# EAGLE design imuv1.3 (EAGLE 7.4.0)
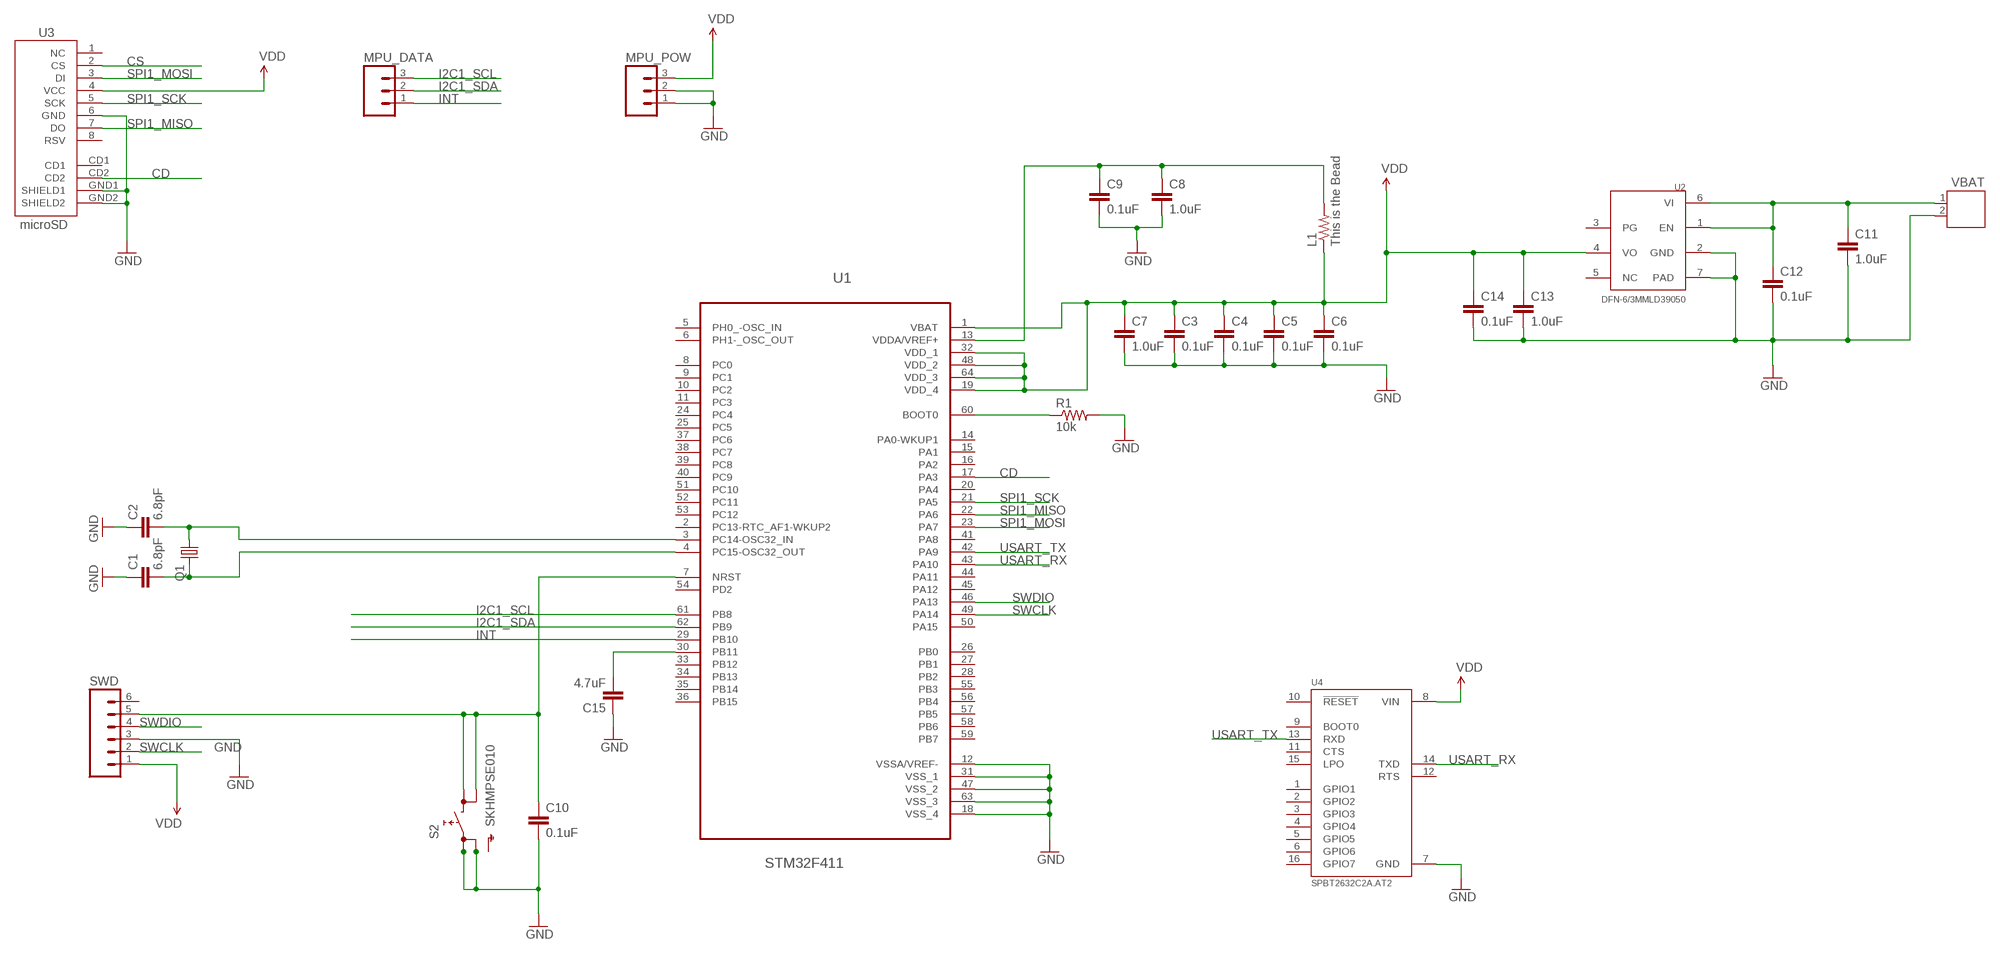
[diagram p0: schematic, sheet 1]

## Parts
C1  6.8pF  1.0PF-50V(-/+.25PF)(0603)  [0603-CAP]
C2  6.8pF  1.0PF-50V(-/+.25PF)(0603)  [0603-CAP]
C3  0.1uF  0.1UF-100V-10%(0603)  [0603-CAP]
C4  0.1uF  0.1UF-100V-10%(0603)  [0603-CAP]
C5  0.1uF  0.1UF-100V-10%(0603)  [0603-CAP]
C6  0.1uF  0.1UF-100V-10%(0603)  [0603-CAP]
C7  1.0uF  1.0UF-16V-10%(0603)  [0603-CAP]
C8  1.0uF  1.0UF-16V-10%(0603)  [0603-CAP]
C9  0.1uF  0.1UF-100V-10%(0603)  [0603-CAP]
C10  0.1uF  0.1UF-100V-10%(0603)  [0603-CAP]
C11  1.0uF  1.0UF-16V-10%(0603)  [0603-CAP]
C12  0.1uF  0.1UF-100V-10%(0603)  [0603-CAP]
C13  1.0uF  1.0UF-16V-10%(0603)  [0603-CAP]
C14  0.1uF  0.1UF-100V-10%(0603)  [0603-CAP]
C15  4.7uF  4.7UF-16V-20%,+80%-(1206)  [1206-CAP]
L1  This is the Bead  1OHM1/10W1%(0603)  [0603-RES]
MPU_DATA  M03PTH  [1X03]
MPU_POW  M03PTH  [1X03]
Q1  CRYSTALMM20SS  [MM20SS]
R1  10k  470OHM1/10W1%(0603)  [0603-RES]
S2  SKHMPSE010  [SKHMPXE010]
SWD  M06SILK_FEMALE_PTH  [1X06]
U1  STM32F411  STM32L152RBT6STM32F411  [QFP50P1200X1200X160-64N]
U2  DFN-6/3MMLD39050  [DFN-6/3MM]
U3  microSD  USD-SOCKETSMD  [MICRO-SD-SOCKET-PP]
U4  SPBT2632C2A.AT2  [XCVR_SPBT2632C2A.AT2]
VBAT  JST-PH2  [JST-PH2]

## Nets
CD: U1.17(PA3) U3.CD2
CS: U3.2(CS)
GND: C1.1 C2.1 C3.2 C4.2 C5.2 C6.2 C7.2 C8.2 C9.2 C10.2 C11.2 C12.2 C13.2 C14.2 C15.1 MPU_POW.1 MPU_POW.2 R1.2 S2.1(1.1) S2.2(1.2) SWD.3 U1.12(VSSA/VREF-) U1.18(VSS_4) U1.31(VSS_1) U1.47(VSS_2) U1.63(VSS_3) U2.2(GND) U2.7(PAD) U3.6(GND) U3.GND1(SHIELD1) U3.GND2(SHIELD2) U4.7(GND) VBAT.2
I2C1_SCL: MPU_DATA.3 U1.61(PB8)
I2C1_SDA: MPU_DATA.2 U1.62(PB9)
INT: MPU_DATA.1 U1.29(PB10)
N$1: C1.2 Q1.4 U1.4(PC15-OSC32_OUT)
N$2: C10.1 S2.3(2.1) S2.4(2.2) SWD.5 U1.7(NRST)
N$3: R1.1 U1.60(BOOT0)
N$4: C8.1 C9.1 L1.2 U1.13(VDDA/VREF+)
N$5: C2.2 Q1.1 U1.3(PC14-OSC32_IN)
N$6: C11.1 C12.1 U2.1(EN) U2.6(VI) VBAT.1
N$7: C15.2 U1.30(PB11)
SPI1_MISO: U1.22(PA6) U3.7(DO)
SPI1_MOSI: U1.23(PA7) U3.3(DI)
SPI1_SCK: U1.21(PA5) U3.5(SCK)
SWCLK: SWD.2 U1.49(PA14)
SWDIO: SWD.4 U1.46(PA13)
USART_RX: U1.43(PA10) U4.14(TXD)
USART_TX: U1.42(PA9) U4.13(RXD)
VDD: C3.1 C4.1 C5.1 C6.1 C7.1 C13.1 C14.1 L1.1 MPU_POW.3 SWD.1 U1.1(VBAT) U1.19(VDD_4) U1.32(VDD_1) U1.48(VDD_2) U1.64(VDD_3) U2.4(VO) U3.4(VCC) U4.8(VIN)
Unconnected: S2.5(SH) SWD.6 U1.2(PC13-RTC_AF1-WKUP2) U1.5(PH0_-OSC_IN) U1.6(PH1-_OSC_OUT) U1.8(PC0) U1.9(PC1) U1.10(PC2) U1.11(PC3) U1.14(PA0-WKUP1) U1.15(PA1) U1.16(PA2) U1.20(PA4) U1.24(PC4) U1.25(PC5) U1.26(PB0) U1.27(PB1) U1.28(PB2) U1.33(PB12) U1.34(PB13) U1.35(PB14) U1.36(PB15) U1.37(PC6) U1.38(PC7) U1.39(PC8) U1.40(PC9) U1.41(PA8) U1.44(PA11) U1.45(PA12) U1.50(PA15) U1.51(PC10) U1.52(PC11) U1.53(PC12) U1.54(PD2) U1.55(PB3) U1.56(PB4) U1.57(PB5) U1.58(PB6) U1.59(PB7) U3.1(NC) U3.8(RSV) U3.CD1 U4.1(GPIO1) U4.2(GPIO2) U4.3(GPIO3) U4.4(GPIO4) U4.5(GPIO5) U4.6(GPIO6) U4.9(BOOT0) U4.10(!RESET) U4.11(CTS) U4.12(RTS) U4.15(LPO) U4.16(GPIO7)

## Power pins joined to a net without a drawn wire
NC: U2.5(NC)
PG: U2.3(PG)

## Library data of the parts
C1 C2 = SparkFun-Capacitors:1.0PF-50V(-/+.25PF)(0603): CAP-07879; PROD_ID: CAP-07879; VALUE: 1.0pF
C3-C6 C9 C10 C12 C14 = SparkFun-Capacitors:0.1UF-100V-10%(0603): CAP-08390; PROD_ID: CAP-08390
C7 C8 C11 C13 = SparkFun-Capacitors:1.0UF-16V-10%(0603): CAP-00868; PROD_ID: CAP-00868
C15 = SparkFun-Capacitors:4.7UF-16V-20%,+80%-(1206): CAP-10300; PROD_ID: CAP-10300
L1 = SparkFun-Resistors:1OHM1/10W1%(0603): RES-08269; PROD_ID: RES-08269; VALUE: 1
MPU_DATA MPU_POW = SparkFun-Connectors:M03: Header 3 Standard 3-pin 0.1" header. Use with straight break away headers (SKU : PRT-00116), right angle break away headers (PRT-00553), swiss pins (PRT-00743), machine pins (PRT-00117), and female headers (PRT-00115). Molex polarized connector foot print use with SKU : PRT-08232 with associated crimp pins and housings.
Q1 = crystal:CRYSTAL: CRYSTAL; OC_FARNELL: unknown; OC_NEWARK: unknown
R1 = SparkFun-Resistors:470OHM1/10W1%(0603): RES-07869; PROD_ID: RES-07869; VALUE: 470
S2 = switch:SKHMP*E010: 6.2 X 6.5mm TACT Switch (SMD) Source: http://www3.alps.co.jp/WebObjects/catalog.woa/PDF/E/Switch/Tact/SKHM/SKHM.PDF
SWD = SparkFun-Connectors:M06: Header 6 Standard 6-pin 0.1" header. Use with straight break away headers (SKU : PRT-00116), right angle break away headers (PRT-00553), swiss pins (PRT-00743), machine pins (PRT-00117), and female headers (PRT-00115). Molex polarized connector foot print use with SKU : PRT-08094 with associated crimp pins and housings. NOTES ON THE VARIANTS LOCK and LOCK_LONGPADS... This footprint was designed to help hold the alignment of a through-hole component (i.e. 6-pin header) while soldering it into place. You may notice that each hole has been shifted either up or down by 0.005 of an inch from it's more standard position (which is a perfectly straight line). This slight alteration caused the pins (the squares in the middle) to touch the edges of the holes. Because they are alternating, it causes a "brace" to hold the component in place. 0.005 has proven to be the perfect amount of "off-center" position when using our standard breakaway headers. Although looks a little odd when you look at the bare footprint, once you have a header in there, the alteration is very hard to notice. Also,if you push a header all the way into place, it is covered up entirely on the bottom side. This idea of altering the position of holes to aid alignment will be further integrated into the Sparkfun Library for other footprints. It can help hold any component with 3 or more connection pins.; PROD_ID: CONN-08437
U1 = ST Microelctronics_By_element14_Batch_1:STM32L152RBT6: ARM-based 32-bit MCU STM32F411; STM32F411: STM32F411
U2 = DFN-6_3MM:DFN-6/3MM: This the customer made symbol for voltage regulater LD39050. Package is using DFN-6 3x3mm
U3 = SparkFun:USD-SOCKET: microSD Socket Push-push type uSD socket. Schematic element and footprint production proven. Spark Fun Electronics SKU : PRT-00127. tDoc lines correctly indicate media card edge positions when inserting (unlocked, locked, depressed).
U4 = SPBT2632C2A.AT2:SPBT2632C2A.AT2: Bluetooth V3.0 module class 2 with antenna, supporting SPP and iAP with AT2 command set
VBAT = jst-ph:JST-PH2

## Board
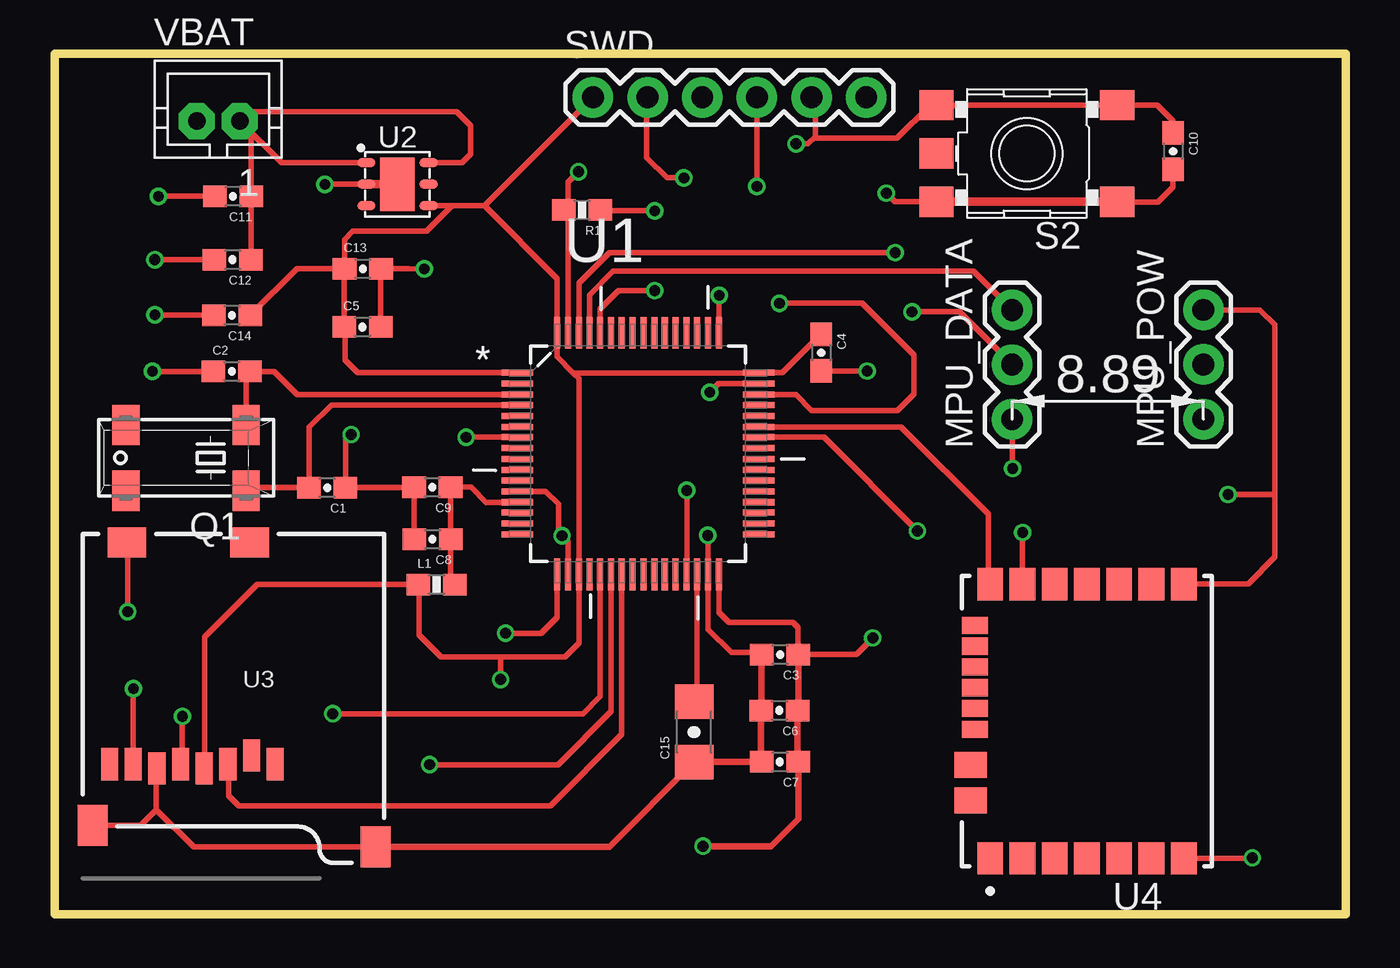
[diagram p1: board, top side]
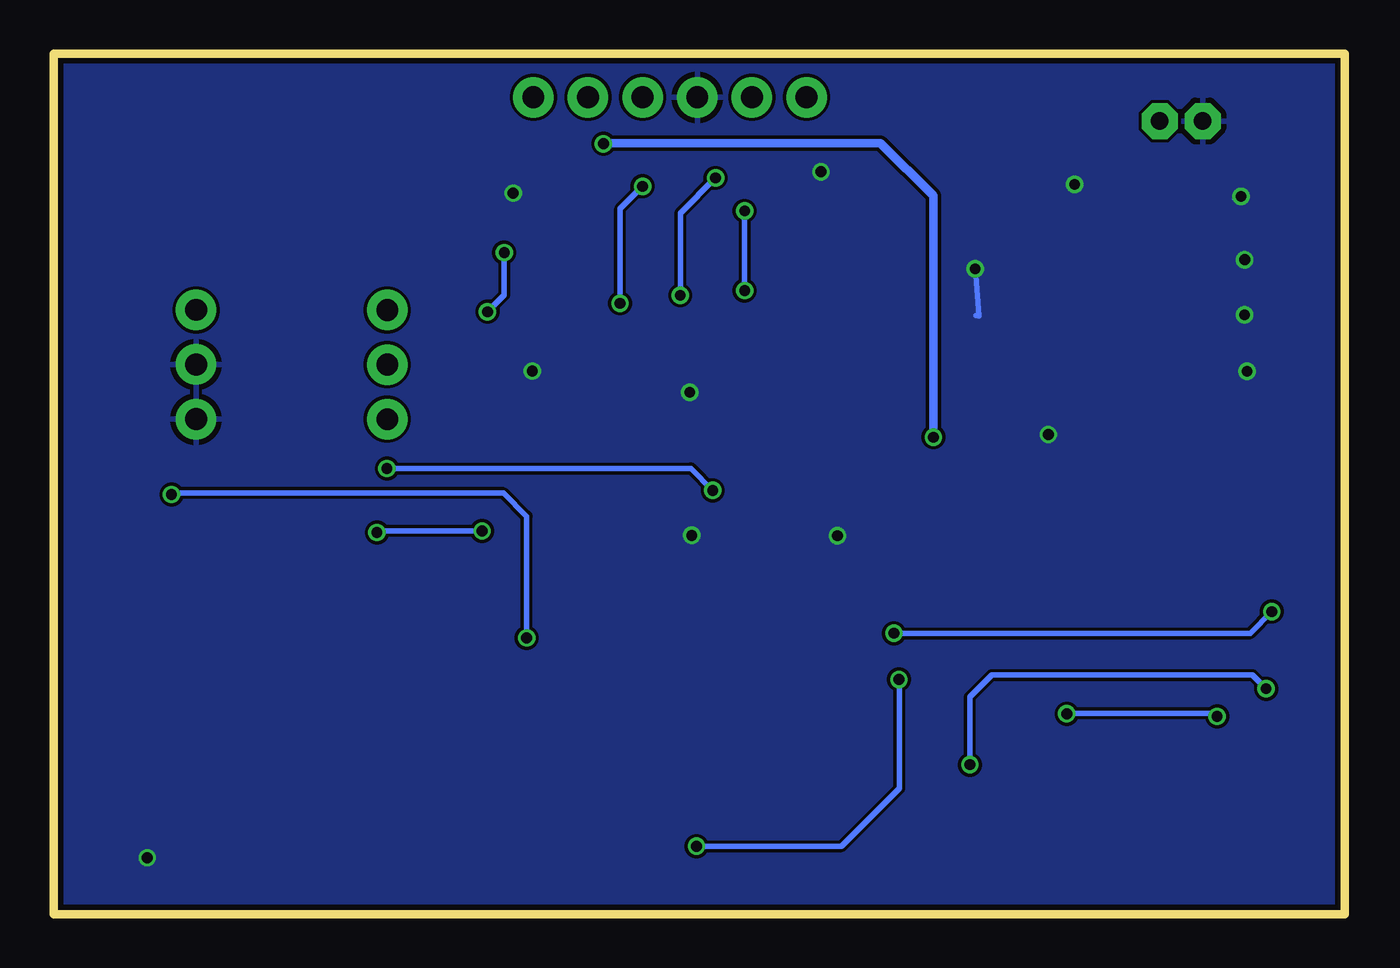
[diagram p2: board, bottom side, seen from below]

Size 60.05 x 40 mm. Coordinates in mm from the lower left corner, seen from the top.
Outline: 59.98,0 59.99,0.21 60,36.8
Outline: 0.05,36.8 0,36.8
Outline: 0.05,0.04 0.06,0.04
Outline: 0.05,0 0.05,40 60.05,40 60.05,0 0.05,0
Copper layers (1*16): Top 0.035mm / dielectric 1.5mm / Bottom 0.035mm
Design rules "ITEADstudioDRC": minimum track width 6mil, minimum drill 12mil, track to track 6mil, track to pad 6mil, pad to pad 6mil, via to via 6mil, smd to smd 0mil, copper to edge 10mil, drill to drill 10mil, minimum pad ring 10mil, minimum via ring 6mil, stop-mask expansion 2mil, vias tented up to drill 100mil, thermal gap 10mil

### Footprints (pad centres in the part's own frame; a part is rotated, then mirrored left to right if it is on the bottom)
0603-CAP = smd 1.1 x 1: 1 -0.85,0; 2 0.85,0
1206-CAP = smd 1.6 x 1.8: 1 -1.4,0; 2 1.4,0
0603-RES = smd 1.1 x 1: 1 -0.85,0; 2 0.85,0
1X03 = drill 1.016 pad 1.88: 1 0,0; 2 2.54,0; 3 5.08,0
MM20SS = smd 1.27 x 1.88: 1 -2.794,-1.524; 2 2.794,-1.524; 3 2.794,1.524; 4 -2.794,1.524
SKHMPXE010 = smd 1.6 x 1.4: 1 -4.2,2.25; 2 4.2,2.25; 3 -4.2,-2.25; 4 4.2,-2.25; 5 4.2,0
1X06 = drill 1.016 pad 1.88: 1 0,0; 2 2.54,0; 3 5.08,0; 4 7.62,0; 5 10.16,0; 6 12.7,0
QFP50P1200X1200X160-64N = smd 1.473 x 0.279: 1 -5.613,3.759; 2 -5.613,3.251; 3 -5.613,2.743; 4 -5.613,2.261; 5 -5.613,1.753; 6 -5.613,1.245; 7 -5.613,0.762; 8 -5.613,0.254; 9 -5.613,-0.254; 10 -5.613,-0.762; 11 -5.613,-1.245; 12 -5.613,-1.753; 13 -5.613,-2.261; 14 -5.613,-2.743; 15 -5.613,-3.251; 16 -5.613,-3.759; 33 5.613,-3.759; 34 5.613,-3.251; 35 5.613,-2.743; 36 5.613,-2.261; 37 5.613,-1.753; 38 5.613,-1.245; 39 5.613,-0.762; 40 5.613,-0.254; 41 5.613,0.254; 42 5.613,0.762; 43 5.613,1.245; 44 5.613,1.753; 45 5.613,2.261; 46 5.613,2.743; 47 5.613,3.251; 48 5.613,3.759 | smd 0.279 x 1.473: 17 -3.759,-5.613; 18 -3.251,-5.613; 19 -2.743,-5.613; 20 -2.261,-5.613; 21 -1.753,-5.613; 22 -1.245,-5.613; 23 -0.762,-5.613; 24 -0.254,-5.613; 25 0.254,-5.613; 26 0.762,-5.613; 27 1.245,-5.613; 28 1.753,-5.613; 29 2.261,-5.613; 30 2.743,-5.613; 31 3.251,-5.613; 32 3.759,-5.613; 49 3.759,5.613; 50 3.251,5.613; 51 2.743,5.613; 52 2.261,5.613; 53 1.753,5.613; 54 1.245,5.613; 55 0.762,5.613; 56 0.254,5.613; 57 -0.254,5.613; 58 -0.762,5.613; 59 -1.245,5.613; 60 -1.753,5.613; 61 -2.261,5.613; 62 -2.743,5.613; 63 -3.251,5.613; 64 -3.759,5.613
DFN-6/3MM = smd 0.85 x 0.45: 1 -1.45,1; 2 -1.45,0; 3 -1.45,-1; 4 1.45,-1; 5 1.45,0; 6 1.45,1 | smd 1.6 x 2.5: 7 0,0
MICRO-SD-SOCKET-PP = smd 0.8 x 1.5: 1 -8.94,10.7; 2 -7.84,10.3; 3 -6.74,10.7; 4 -5.64,10.9; 5 -4.54,10.7; 6 -3.44,10.9; 7 -2.34,10.7; 8 -1.24,10.7 | smd 1.8 x 1.4: CD1 -7.75,0.4; CD2 -2.05,0.4 | smd 1.4 x 1.9: GND1 -13.6,14.55; GND2 -0.45,13.55
XCVR_SPBT2632C2A.AT2 = smd 1.5 x 1.2: 1 -6.37,4.5; 2 -6.37,3; 3 -6.37,1.5; 4 -6.37,0; 5 -6.37,-1.5; 6 -6.37,-3; 7 -6.37,-4.5; 8 6.37,-4.5; 9 6.37,-3; 10 6.37,-1.5; 11 6.37,0; 12 6.37,1.5; 13 6.37,3; 14 6.37,4.5 | smd 1.2 x 1.5: 15 -2.02,5.4; 16 -3.67,5.4 | smd 0.8 x 1.2: 17 -0.37,5.2; 18 0.595,5.2; 19 1.56,5.2; 20 2.525,5.2; 21 3.49,5.2; 22 4.455,5.2
JST-PH2 = drill 0.813 pad 1.676 octagon: 1 1,0; 2 -1,0

### Placement (x,y rotation side)
C1  12.71,19.83 180 top
C2  8.27,25.24 0 top
C3  33.75,12.07 180 top
C4  35.67,26.11 270 top
C5  14.35,27.3 0 top
C6  33.73,9.47 180 top
C7  33.75,7.08 180 top
C8  17.6,17.43 180 top
C9  17.6,19.84 180 top
C10  52.02,35.47 270 top
C11  8.33,33.37 180 top
C12  8.31,30.43 180 top
C13  14.37,30.01 0 top
C14  8.29,27.84 180 top
C15  29.76,8.47 90 top
L1  17.79,15.33 0 top
MPU_DATA  44.55,23.01 90 top
MPU_POW  53.44,23.01 90 top
Q1  6.15,21.22 180 top
R1  24.55,32.74 180 top
S2  45.22,35.37 180 top
SWD  25.06,37.97 0 top
U1  27.15,21.41 0 top
U2  15.97,33.93 0 top
U3  1.35,17.68 180 top
U4  48.02,8.97 90 top
VBAT  7.65,36.87 0 top

### Tracks (layer width: path | path; a pad name or v marks a point on that pad's centre or on a via)
CD  (via drill 0.5)
  Top 0.254: U1.17 23.39,13.79 22.66,13.05 v21.01,13.05 v21,13.06 | v3.43,14.07 3.43,17.25 U3.CD2
  Bottom 0.254: v21,13.06 4.44,13.06 v3.43,14.07
GND  (via drill 0.5)
  Top 0.254: C2.1 v4.59,25.24 | C14.2 4.72,27.84 v4.71,27.86 | C12.2 v4.7,30.43 | C11.2 v4.87,33.37 | U2.2 12.62,33.93 v12.61,33.93 | v17.22,30 16.47,30 C13.2 15.2,29.99 C5.2 | v13.82,22.3 13.56,22.04 C1.1 13.57,19.84 C9.2 C8.2 | C10.2 52.02,33.81 51.32,33.11 S2.1 | 33.27,12.44 C3.2 32.81,12.16 31.49,12.16 30.41,13.25 U1.31 v30.41,17.6 v30.4,17.61 | U3.GND2 4.04,4.13 4.77,4.86 | 4.77,4.86 4.77,6.75 U3.6 | U3.GND1 6.5,3.13 4.77,4.86 | 23.9,32.54 23.9,34.02 v24.39,34.51 | U1.63 23.9,32.54 | 23.9,32.54 R1.2 | U1.18 23.9,17.32 v23.62,17.6 23.46,17.76 23.46,19.06 22.87,19.66 U1.12 | U1.47 30.89,24.66 v30.49,24.26 | C4.2 v37.8,25.26 v37.8,25.25 | S2.2 39.11,33.12 v38.7,33.52 | U4.7 55.68,2.6 v55.71,2.63
  Top 0.305: C3.2 32.9,9.5 C6.2 32.88,7.11 C7.2 29.78,7.08 C15.1 25.82,3.13 U3.GND1
  Top 0.406: U2.2 U2.7 | S2.2 S2.1
  Bottom 0.254: v4.59,25.24 4.53,25.24 4.51,25.22 | v4.71,27.86 4.67,27.86 4.65,27.88 | v4.7,30.43 4.6,30.43 4.59,30.44 | v4.87,33.37 4.8,33.37 4.79,33.35 4.69,33.35 4.66,33.38 4.79,33.38 5.15,33.26 4.85,33.32 4.88,33.29 | v12.61,33.93 v12.6,33.94 | v17.22,30 17.06,27.83 | 17.18,27.83 17.06,27.83 | 17.06,27.83 17.05,27.81 | v13.82,22.3 13.84,22.3 13.98,22.44 | v24.39,34.51 24.42,34.51 24.59,34.68 | v23.62,17.6 23.49,17.74 | v30.49,24.26 v30.48,24.26 30.4,24.18 | v37.8,25.25 37.96,25.25 37.97,25.26 | v38.7,33.52 38.66,33.52 38.48,33.7 | v30.4,17.61 30.4,17.71 30.39,17.72 | v55.71,2.63 55.94,2.63 55.98,2.59
  pour Bottom: 0.59,39.49 59.56,39.49 59.56,0.53 0.58,0.53 0.58,39.49
I2C1_SCL
  Top 0.254: U1.61 24.89,28.79 26,29.9 42.74,29.9 MPU_DATA.3
I2C1_SDA  (via drill 0.5)
  Top 0.254: U1.62 24.41,29.33 25.84,30.76 v39.11,30.76 v39.11,30.75 | v39.89,28.01 42.09,28.01 MPU_DATA.2
  Bottom 0.254: v39.11,30.75 39.11,28.79 v39.89,28.01
INT  (via drill 0.5)
  Top 0.254: MPU_DATA.1 44.55,20.74 v44.56,20.72 | v29.42,19.7 29.42,15.81 U1.29
  Bottom 0.254: v44.56,20.72 30.44,20.72 v29.42,19.7
N$1
  Top 0.254: 8.87,19.62 Q1.4 9.08,19.83 C1.2 11.88,19.85 11.88,22.65 12.91,23.67 U1.4
N$2  (via drill 0.5)
  Top 0.254: v34.5,35.81 35.06,35.81 35.39,36.15 | 35.39,36.15 35.39,37.8 SWD.5 | S2.4 42.25,37.57 | 35.39,36.15 35.46,36.08 39.2,36.08 40.74,37.62 S2.4 | U1.7 v19.17,22.17 v19.17,22.18 | S2.4 S2.3 51.29,37.62 52.02,36.88 C10.1
  Bottom 0.254: 34.48,35.8 v34.5,35.81
  Bottom 0.406: v19.17,22.18 19.17,33.39 21.62,35.84 34.47,35.84 v34.5,35.81
N$3  (via drill 0.5)
  Top 0.254: U1.60 25.4,28.14 26.25,28.99 v27.94,28.99 | v27.94,32.7 25.45,32.7 R1.1
  Bottom 0.254: v27.94,32.7 v27.94,28.99
N$4
  Top 0.254: C8.1 C9.1 18.47,19.86 19.39,19.86 20.1,19.15 U1.13 | C8.1 | C8.1 18.45,15.53 L1.2
N$5
  Top 0.254: Q1.1 8.94,25.06 C2.2 | 9.14,25.26 C2.2 | 9.13,25.25 C2.2 | U1.3 11.31,24.16 10.24,25.22 9.14,25.22 C2.2
N$6
  Top 0.254: C12.1 9.16,33.35 C11.1 9.18,36.34 VBAT.1 | U2.1 10.59,34.93 VBAT.1 | U2.6 18.98,34.93 19.37,35.33 19.37,36.65 18.72,37.31 9.08,37.31 VBAT.1
N$7
  Top 0.254: U1.30 29.9,10.01 C15.2
SPI1_MISO  (via drill 0.5)
  Top 0.254: U1.22 25.91,9.42 23.44,6.95 v17.48,6.95 v17.47,6.95 | v3.7,10.48 U3.7
  Bottom 0.254: v17.47,6.95 17.47,10.1 16.45,11.12 4.34,11.12 v3.7,10.48
SPI1_MOSI
  Top 0.254: U1.23 26.39,8.36 23.08,5.05 8.6,5.05 8.14,5.51 8.14,6.94 U3.3
SPI1_SCK  (via drill 0.5)
  Top 0.254: U1.21 25.4,10.12 24.6,9.32 v12.97,9.32 | U3.5 5.98,7.06 v5.98,9.2
  Bottom 0.254: v5.98,9.2 5.98,9.33 12.96,9.33 v12.97,9.32
SWCLK  (via drill 0.5)
  Top 0.254: U1.49 30.91,28.75 v30.93,28.77 | v29.29,34.23 28.51,34.23 27.56,35.18 27.56,37.94 SWD.2
  Bottom 0.254: v30.93,28.77 30.93,32.59 v29.29,34.23
SWDIO  (via drill 0.5)
  Top 0.254: U1.46 34.49,24.16 35.22,23.42 39.22,23.42 39.97,24.17 39.97,25.99 37.56,28.4 v33.73,28.4 | v32.68,33.84 SWD.4
  Bottom 0.254: v33.73,28.4 33.73,32.79 v32.68,33.84
USART_RX
  Top 0.254: U1.43 39.37,22.66 43.43,18.6 43.43,15.43 U4.14
USART_TX  (via drill 0.5)
  Top 0.254: U1.42 35.79,22.17 v40.14,17.82 | v45.03,17.74 U4.13
  Bottom 0.254: v40.14,17.82 44.95,17.82 v45.03,17.74
VDD  (via drill 0.5)
  Top 0.254: U2.4 18.52,32.93 | 18.52,32.93 20.02,32.93 | 20.02,32.93 SWD.1 | C13.1 11.3,30.01 C14.1 | C13.1 13.5,29.99 C5.1 13.54,27.26 13.54,25.76 14.13,25.17 U1.1 | C13.1 13.52,31.36 13.9,31.74 17.34,31.74 18.52,32.93 | 34.33,12.35 34.59,12.09 | 20.02,32.93 23.39,29.55 U1.64 23.39,25.91 24.14,25.16 | L1.1 9.45,15.33 7.01,12.89 7.01,6.8 U3.4 | 16.96,15.31 L1.1 | 24.14,25.16 U1.48 33.88,25.17 C4.1 | 24.14,25.16 24.41,24.9 U1.19 24.41,12.6 23.77,11.96 20.82,11.96 | U1.32 30.91,14.04 31.39,13.56 34.35,13.56 34.59,13.32 34.59,12.09 | 34.59,12.09 C3.1 | 56.75,19.54 56.75,27.41 56.07,28.09 MPU_POW.3 53.38,28.09 | 56.75,19.54 56.75,16.6 55.51,15.36 52.54,15.36 U4.8 | 34.59,12.09 37.31,12.09 v38.07,12.85 | v54.58,19.52 56.73,19.52 56.75,19.54 | 34.58,7.11 C7.1 | 20.82,11.96 18.01,11.96 16.97,12.99 16.97,15.3 L1.1 | v20.77,10.91 20.77,11.9 20.82,11.96
  Top 0.305: C3.1 34.6,9.5 C6.1 34.58,7.11 | C7.1 34.6,4.44 33.33,3.16 v30.17,3.16
  Bottom 0.254: v30.17,3.16 23.43,3.16 20.75,5.85 20.75,10.89 v20.77,10.91 | v38.07,12.85 38.07,18.5 39.15,19.58 54.51,19.58 v54.58,19.52